# Altium schematic sheet MCU_DAQ.SchDoc
size A3
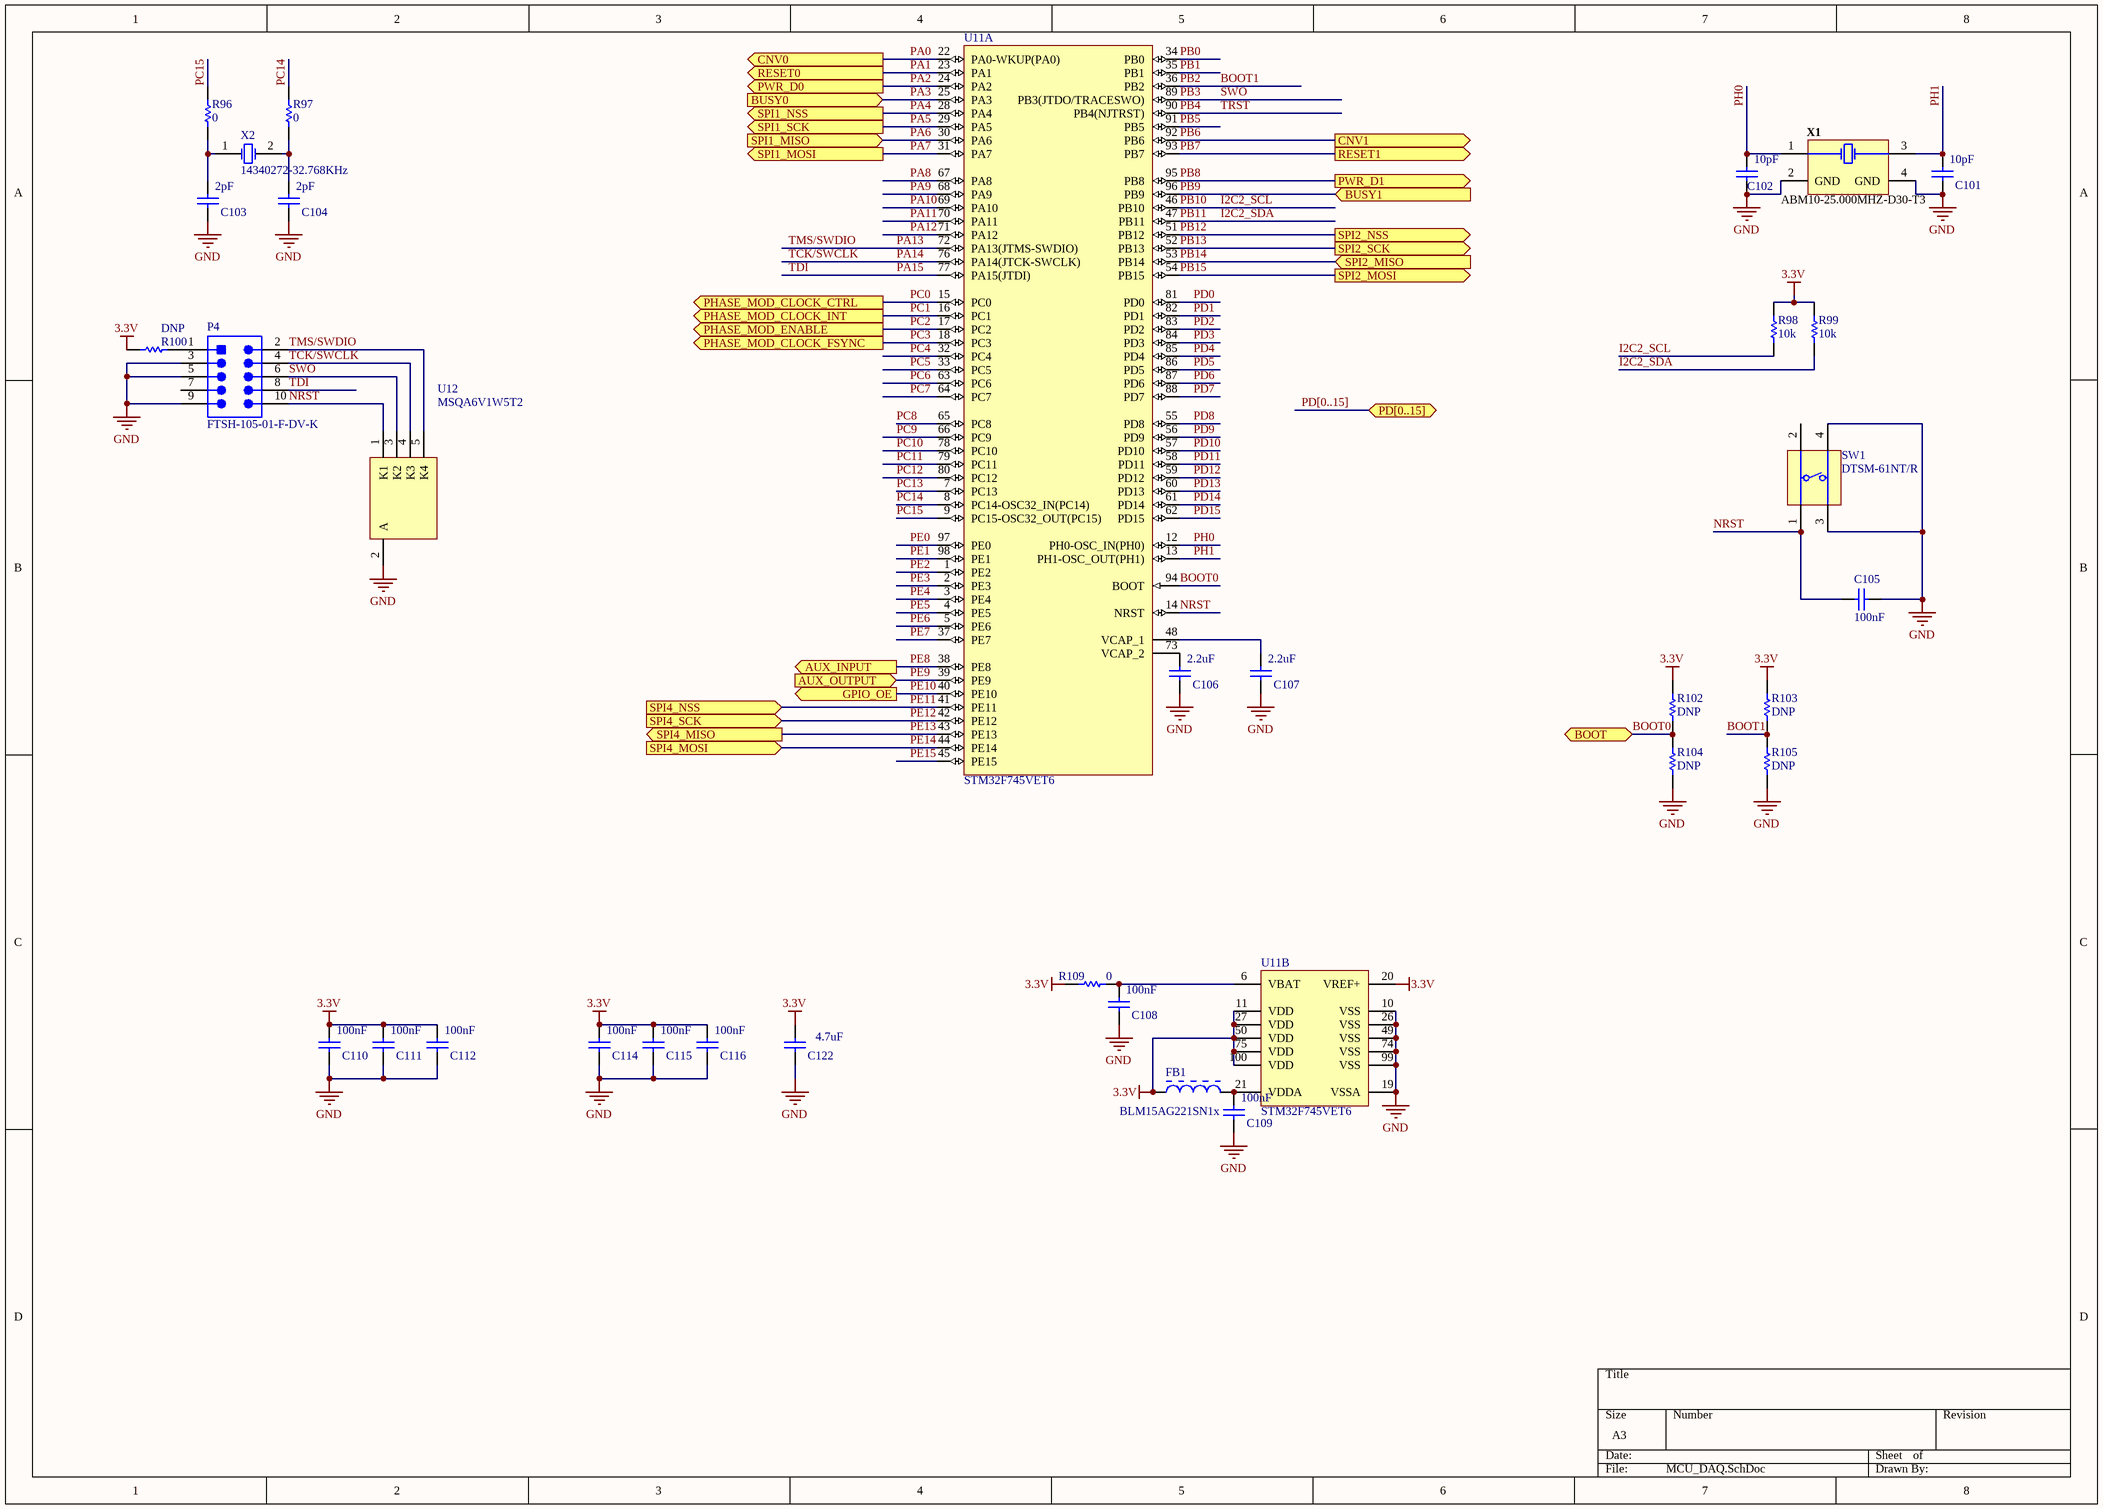
[diagram p0: MCU_DAQ.SchDoc]

## Parts
C101  value 10pF  [CAPC0402(1005)60_L]  (hidden comment: CAP0402)
C102  value 10pF  [CAPC0402(1005)60_L]  (hidden comment: CAP0402)
C103  value 2pF  [CAPC0402(1005)60_L]  (hidden comment: CAP0402)
C104  value 2pF  [CAPC0402(1005)60_L]  (hidden comment: CAP0402)
C105  value 100nF  [CAPC0402(1005)60_L]  (hidden comment: CAP0402)
C106  value 2.2uF  [CAPC0402(1005)60_L]  (hidden comment: CAP0402)
C107  value 2.2uF  [CAPC0402(1005)60_L]  (hidden comment: CAP0402)
C108  value 100nF  [CAPC0402(1005)60_L]  (hidden comment: CAP0402)
C109  value 100nF  [CAPC0402(1005)60_L]  (hidden comment: CAP0402)
C110  value 100nF  [CAPC0402(1005)60_L]  (hidden comment: CAP0402)
C111  value 100nF  [CAPC0402(1005)60_L]  (hidden comment: CAP0402)
C112  value 100nF  [CAPC0402(1005)60_L]  (hidden comment: CAP0402)
C114  value 100nF  [CAPC0402(1005)60_L]  (hidden comment: CAP0402)
C115  value 100nF  [CAPC0402(1005)60_L]  (hidden comment: CAP0402)
C116  value 100nF  [CAPC0402(1005)60_L]  (hidden comment: CAP0402)
C122  value 4.7uF  [CAPC0805(2012)145_L]  (hidden comment: CAP0805)
FB1  BLM15AG221SN1x  [MURA-BLM15AG221SN1x_V]
P4  FTSH-105-01-F-DV-K  [SMTC-FTSH-105-01-L-DV-K_V]
R96  value 0  [RESC0402(1005)_L]  (hidden comment: RES0402)
R97  value 0  [RESC0402(1005)_L]  (hidden comment: RES0402)
R98  value 10k  [RESC0402(1005)_L]  (hidden comment: RES0402)
R99  value 10k  [RESC0402(1005)_L]  (hidden comment: RES0402)
R100  value DNP  [RESC0402(1005)_L]  (hidden comment: RES0402)
R102  value DNP  [RESC0402(1005)_L]  (hidden comment: RES0402)
R103  value DNP  [RESC0402(1005)_L]  (hidden comment: RES0402)
R104  value DNP  [RESC0402(1005)_L]  (hidden comment: RES0402)
R105  value DNP  [RESC0402(1005)_L]  (hidden comment: RES0402)
R109  value 0  [RESC0402(1005)_L]  (hidden comment: RES0402)
SW1  DTSM-61NT/R  [DIPT-DTSM-6_V]
U11  STM32F745VET6  [STM-LQFP100_V]  (parts A,B of 2)
U12  MSQA6V1W5T2  [ONSC-SC70-5-419A-02_V]
X1  ABM10-25.000MHZ-D30-T3  [ABRA-ABM10_V]
X2  14340272-32.768KHz  [ITTI-14340272-32.768KHz-2_V]

## Ports
AUX_INPUT (out), AUX_OUTPUT (in), BOOT, BUSY0 (in), BUSY1 (in), CNV0 (out), CNV1 (out), GPIO_OE (out), PD[0..15] (bidir), PHASE_MOD_CLOCK_CTRL (out), PHASE_MOD_CLOCK_FSYNC (out), PHASE_MOD_CLOCK_INT (out), PHASE_MOD_ENABLE (out), PWR_D0 (out), PWR_D1 (out), RESET0 (out), RESET1 (out), SPI1_MISO (in), SPI1_MOSI (out), SPI1_NSS (out), SPI1_SCK (out), SPI2_MISO (in), SPI2_MOSI (out), SPI2_NSS (out), SPI2_SCK (out), SPI4_MISO (out), SPI4_MOSI (in), SPI4_NSS (in), SPI4_SCK (in)

## Nets
3.3V: C110.1 C111.1 C112.1 C114.1 C115.1 C116.1 C122.2 FB1.1 R98.2 R99.2 R100.2 R102.2 R103.2 R109.2 U11.11(VDD) U11.20(VREF+) U11.27(VDD) U11.50(VDD) U11.75(VDD) U11.100(VDD)
GND: C101.2 C102.2 C103.2 C104.2 C105.2 C106.2 C107.2 C108.2 C109.2 C110.2 C111.2 C112.2 C114.2 C115.2 C116.2 C122.1 P4.3 P4.5 P4.9 R104.1 R105.1 SW1.3(T3) SW1.4(T3) U11.10(VSS) U11.19(VSSA) U11.26(VSS) U11.49(VSS) U11.74(VSS) U11.99(VSS) U12.2(A) X1.2(GND) X1.4(GND)
BOOT0: R102.1 R104.2 U11.94(BOOT) ; port BOOT
BOOT1: R103.1 R105.2 U11.36(PB2)  [also labelled PB2]
I2C2_SCL: R98.1 U11.46(PB10)  [also labelled PB10]
I2C2_SDA: R99.1 U11.47(PB11)  [also labelled PB11]
NRST: C105.1 P4.10 SW1.1(T1) U11.14(NRST) U12.1(K1)
PA0: U11.22(PA0-WKUP(PA0)) ; port CNV0
PA1: U11.23(PA1) ; port RESET0
PA2: U11.24(PA2) ; port PWR_D0
PA3: U11.25(PA3) ; port BUSY0
PA4: U11.28(PA4) ; port SPI1_NSS
PA5: U11.29(PA5) ; port SPI1_SCK
PA6: U11.30(PA6) ; port SPI1_MISO
PA7: U11.31(PA7) ; port SPI1_MOSI
PA8: U11.67(PA8)
PA9: U11.68(PA9)
PA10: U11.69(PA10)
PA11: U11.70(PA11)
PA12: U11.71(PA12)
PA13: P4.2 U11.72(PA13(JTMS-SWDIO)) U12.5(K4)  [also labelled TMS/SWDIO]
PA14: P4.4 U11.76(PA14(JTCK-SWCLK)) U12.4(K3)  [also labelled TCK/SWCLK]
PA15: P4.8 U11.77(PA15(JTDI))  [also labelled TDI]
PB0: U11.34(PB0)
PB1: U11.35(PB1)
PB3: P4.6 U11.89(PB3(JTDO/TRACESWO)) U12.3(K2)  [also labelled SWO]
PB4: U11.90(PB4(NJTRST))  [also labelled TRST]
PB5: U11.91(PB5)
PB6: U11.92(PB6) ; port CNV1
PB7: U11.93(PB7) ; port RESET1
PB8: U11.95(PB8) ; port PWR_D1
PB9: U11.96(PB9) ; port BUSY1
PB12: U11.51(PB12) ; port SPI2_NSS
PB13: U11.52(PB13) ; port SPI2_SCK
PB14: U11.53(PB14) ; port SPI2_MISO
PB15: U11.54(PB15) ; port SPI2_MOSI
PC0: U11.15(PC0) ; port PHASE_MOD_CLOCK_CTRL
PC1: U11.16(PC1) ; port PHASE_MOD_CLOCK_INT
PC2: U11.17(PC2) ; port PHASE_MOD_ENABLE
PC3: U11.18(PC3) ; port PHASE_MOD_CLOCK_FSYNC
PC4: U11.32(PC4)
PC5: U11.33(PC5)
PC6: U11.63(PC6)
PC7: U11.64(PC7)
PC8: U11.65(PC8)
PC9: U11.66(PC9)
PC10: U11.78(PC10)
PC11: U11.79(PC11)
PC12: U11.80(PC12)
PC13: U11.7(PC13)
PC14: R97.1 U11.8(PC14-OSC32_IN(PC14))
PC15: R96.1 U11.9(PC15-OSC32_OUT(PC15))
PD0: U11.81(PD0)
PD1: U11.82(PD1)
PD2: U11.83(PD2)
PD3: U11.84(PD3)
PD4: U11.85(PD4)
PD5: U11.86(PD5)
PD6: U11.87(PD6)
PD7: U11.88(PD7)
PD8: U11.55(PD8)
PD9: U11.56(PD9)
PD10: U11.57(PD10)
PD11: U11.58(PD11)
PD12: U11.59(PD12)
PD13: U11.60(PD13)
PD14: U11.61(PD14)
PD15: U11.62(PD15)
PE0: U11.97(PE0)
PE1: U11.98(PE1)
PE2: U11.1(PE2)
PE3: U11.2(PE3)
PE4: U11.3(PE4)
PE5: U11.4(PE5)
PE6: U11.5(PE6)
PE7: U11.37(PE7)
PE8: U11.38(PE8) ; port AUX_INPUT
PE9: U11.39(PE9) ; port AUX_OUTPUT
PE10: U11.40(PE10) ; port GPIO_OE
PE11: U11.41(PE11) ; port SPI4_NSS
PE12: U11.42(PE12) ; port SPI4_SCK
PE13: U11.43(PE13) ; port SPI4_MISO
PE14: U11.44(PE14) ; port SPI4_MOSI
PE15: U11.45(PE15)
PH0: C102.1 U11.12(PH0-OSC_IN(PH0)) X1.1(X1)
PH1: C101.1 U11.13(PH1-OSC_OUT(PH1)) X1.3(X2)
NetC103_1: C103.1 R96.2 X2.1(X1)
NetC104_1: C104.1 R97.2 X2.2(X2)
NetC106_1: C106.1 U11.73(VCAP_2)
NetC107_1: C107.1 U11.48(VCAP_1)
NetC108_1: C108.1 R109.1 U11.6(VBAT)
NetC109_1: C109.1 FB1.2 U11.21(VDDA)
NetP4_1: P4.1 R100.1

Not connected (* = marked no-connect by the designer): P4 7; SW1 2(T2)

## Buses and harness runs
bus PD[0..15] = port PD[0..15]

## Library data of the parts
C101-C112 C114-C116 = CMP-1590-00004-1: 0402 (1005 Metric) Chip Capacitor; Case-EIA: 0402; Case-Metric: 1005; PackageReference: CAPC0402(1005)60
C122 = CMP-1590-00003-1: 0805 (2012 Metric) Chip Capacitor; Case-EIA: 0805; Case-Metric: 2012; PackageReference: CAPC0805(2012)145
FB1 = CMP-1662-00018-3: Chip Bead, 220 Ohm, +/- 25 %, 100 MHz, 300 mA, -55 to 125 degC, 0402 (1005 Metric), RoHS; Tolerance: 25%; Current Rating: 200 mA; Max Current Rating: 450 mA; Resistance: 220 Ohm; Package Quantity: 10000; DatasheetVersion: 03/2011; Radiation Hardening: No; Case Code (Imperial): 0402; Length: 1 mm; RoHSCompliant: True; ComponentLink1URL: http://www.murata.com/; Case/Package: 0402; Width: 0.5 mm; Mounting Technology: Surface Mount; REACH SVHC: No SVHC; Height: 0.5 mm; ComponentLink2Description: Datasheet; PartNumber: BLM15AG221SN1x; ComponentLink1Description: Manufacturer URL; Max Operating Temperature: 125 degC; PackageDescription: 2-Pin Surface Mount Device, Body 1 x 0.5 mm; Case Code (Metric): 1005; ComponentLink2URL: https://datasheet.ciiva.com/11800/0900766b811b5866-11800858.pdf; Min Operating Temperature: -55 degC
P4 = CMP-2000-05352-1: Male Header, Pitch 1.27 mm, 2 x 5 Position, Height 6.12 mm, RoHS, Tube; Manufacturer: Samtec; Number of Positions: 10; Connector Type: Header,Shrouded; Number of Positions Loaded: All; Row Spacing: 0.050"(1.27mm); Fastening Type: -; Package Reference: FTSH-105-01-L-DV-K; Termination: Solder; Package URL: http://suddendocs.samtec.com/prints/ftsh-1xx-xx-xxx-dv-xxx-footprint.pdf; Number of Rows: 2; Contact Finish Thickness: 3µin(0.08µm); Contact Type: MalePin; Manufacturer URL: http://www.samtec.com/; Contact Mating Length: 0.120"(3.05mm); Pitch: 0.050"(1.27mm); Series: FTSH; Features: -; Contact Finish: Gold; Color: Black; Family: RectangularConnectors-Headers,MalePins; Datasheet URL: http://suddendocs.samtec.com/prints/ftsh-1xx-xx-xxx-dv-xxx-mkt.pdf; Package Description: Male Header, Pitch 1.27 mm, 2 x 5 Position, Height 5.97 mm, Tail Length 4.32 mm; Mounting Type: SurfaceMount; Datasheet Version: Rev. ET, 10/1995; Category: Connectors,Interconnects; Packaging: Tube
R96-R100 R102-R105 R109 = CMP-1591-00004-1: 0402 (1005 Metric) Chip Resistor; Case-EIA: 0402; Case-Metric: 1005; PackageReference: RESC0402(1005)
SW1 = CMP-0306-00001-1: Switch, SPNO Push Button SMD; Manufacturer: Diptronics; Packing Type: Tape&Reel; Mechanical Life: 200,000 cycles; ComponentLink2URL: http://www.dip.com.tw/Products_tact.htm; ComponentLink1URL: http://www.dip.com.tw/; ComponentLink3URL: http://www.dip.com.tw/PDF/pro_tact/DTSM_G_-6_2_-V.pdf; PackageDescription: Switch, Through-Hole, 4 Leads, Body 8.5x8.5mm, Row Spacing 9.0mm, Pitch 4.5mm; ComponentLink2Description: Datasheet; ComponentLink3Description: Package Specification; ComponentLink1Description: Manufacturer URL; PackageReference: DTSM-6; PartNumber: DTSM-61NT/R; Mounting Technology: Through Hole
U11 = CMP-1570-00003-1: ARM-Based Cortex-M7 32 Bit MCU+FPU, 462 DMIPS, 512 kB Flash, 320 kB RAM, 82 I/Os, -40 to 85 degC, 100-Pin LQFP, Halogen-Free, Tray; L1 Cache Data Memory: 4 KByte; Supply Voltage Max: 3.6 V; Supply Voltage Min: 1.7 V; Number of I/Os: 82; Clock Frequency Max: 216 MHz; Program Memory Size: 512 KByte; Data RAM Size: 320 KByte; DatasheetVersion: Rev. 1; ComponentLink3Description: Package Specification; L1 Cache Instruction Memory: 4 KByte; ComponentLink1Description: Manufacturer URL; Mounting Technology: Surface Mount; Packing: Tray; ComponentLink3URL: http://www.st.com/st-web-ui/static/active/en/resource/technical/document/data_brief/DM00071938.pdf; ComponentLink2URL: http://www.st.com/st-web-ui/static/active/en/resource/technical/document/datasheet/DM00166116.pdf; ComponentLink1URL: http://www.st.com/web/en/home.html; Temperature Min: -40 degC; ComponentLink2Description: Datasheet; PackageDescription: 100-Pin Low Profile Quad Flat Package, 14 x 14 mm Body, 0.5 mm Pitch; Temperature Max: 85 degC; PartNumber: STM32F745VE
U12 = CMP-1060-00060-1: Quad Array ESD Protection Diodes with Low Clamping Voltage, 5-Pin SC70, Tape and Reel; Manufacturer: On Semiconductor; P Max (W): 0.385; Packing: Tape and Reel; DatasheetVersion: Rev. 7; ComponentLink2URL: http://www.onsemi.com/pub_link/Collateral/MSQA6V1W5T2-D.PDF; PackageDescription: 5-Pin Small Outline Transistor, Body 2 x 1.25 mm, Pitch 0.65 mm; PackageVersion: Rev. L, 01/2013; ComponentLink1URL: http://www.onsemi.com/; ComponentLink2Description: Datasheet; ComponentLink3Description: Package Specification; Mounting Technology: Surface Mount; ComponentLink1Description: Manufacturer URL; PackageReference: SC70-5-419A-02; PartNumber: MSQA6V1W5T2; ComponentLink3URL: http://www.onsemi.cn/pub_link/Collateral/419A-02.PDF
X1 = CMP-2000-05727-1: Ceramic SMD Ultra Miniature Quartz Crystal, 25 MHz, 100 Ohm, 10 pF, -40 to 85 degC, 4-Pin SMD, RoHS, Tape and Reel; Manufacturer: ABRACON; Case Width: 2mm; Case Length: 2.5mm; Frequency: 25MHz; ESR: 100Ohms; Load Capacitance: 10pF; Case Height: 0.5mm; Tolerance: 20PPM; Frequency Stability: 30PPM; Manufacturer URL: http://www.abracon.com/; Datasheet URL: https://datasheet.ciiva.com/4946/abm10-31166-4946144.pdf; Type: UltraMiniatureQuartzCrystal; Series: ABM10; Mounting Style: SMD/SMT; Operating Temperature Range: -40Cto+85C; Mounting Technology: SurfaceMount; Factory Pack Quantity: 3000; Datasheet Version: 01/2013; Packaging: Reel; Brand: ABRACON; Package Description: 4-Pin Surface Mount Device, Body 2 x 2.5 mm, Pitch 1.65 mm; Termination Style: SMD/SMT; Product Category: Crystals; Package / Case: 2.5mmx2mmx0.5mm; Dimensions: 2mmWx2.5mmLx0.5mmH; RoHS: Details; Package Reference: ABM10
X2 = CMP-0463-00001-2: Crystal, 32.768 KHz, -40 to 85 degC, 3.2 x 1.5 x 0.9 mm SMD; Manufacturer: ITTI; Load Capacitance: 12.5 pF; Frequency Tolerance: +/-20 ppm; Drive Level: 1 max. uw; Nominal Frequency: 32.768KHz; Mounting Technology: Surface Mount; Operating temperature: -40 to 85 degC; PartNumber: 14340272-32.768KHz; ComponentLink1URL: http://www.itti-co.com; ComponentLink1Description: Manufacturer URL; PackageReference: 14340272-32.768KHz-2; PackageDescription: 2-Pin Hand Drawn, Body 3.2 x 1.5mm, Pitch 2.5 mm